# Altium schematic sheet RS485.SchDoc: RS485
size A4
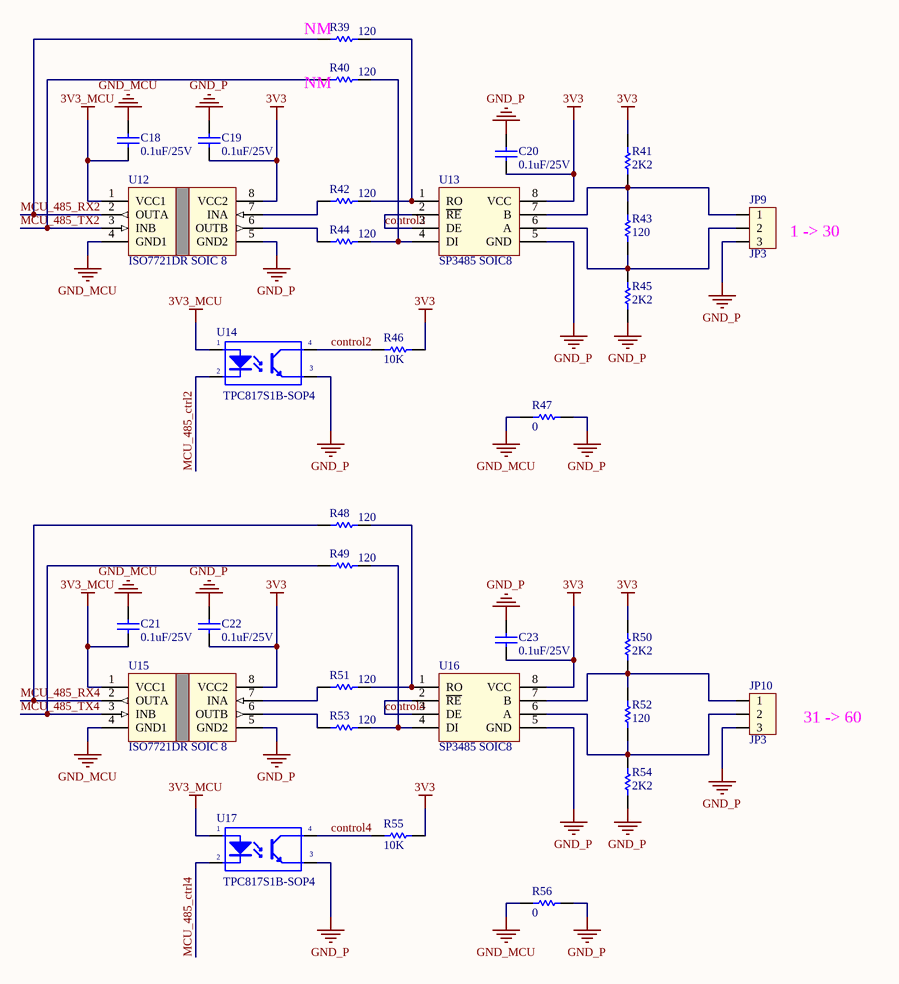
[diagram p0: RS485.SchDoc]

## Parts
C18  0.1uF/25V  [Cap Ceramic 0805 SMD]
C19  0.1uF/25V  [Cap Ceramic 0805 SMD]
C20  0.1uF/25V  [Cap Ceramic 0805 SMD]
C21  0.1uF/25V  [Cap Ceramic 0805 SMD]
C22  0.1uF/25V  [Cap Ceramic 0805 SMD]
C23  0.1uF/25V  [Cap Ceramic 0805 SMD]
JP9  JP3  [2EDGR-5.08-03P]
JP10  JP3  [2EDGR-5.08-03P]
R39  120  [Res 0805 SMD]
R40  120  [Res 0805 SMD]
R41  2K2  [Res 0805 SMD]
R42  120  [Res 0805 SMD]
R43  120  [Res 0805 SMD]
R44  120  [Res 0805 SMD]
R45  2K2  [Res 0805 SMD]
R46  10K  [Res 0805 SMD]
R47  0  [Res 0805 SMD]
R48  120  [Res 0805 SMD]
R49  120  [Res 0805 SMD]
R50  2K2  [Res 0805 SMD]
R51  120  [Res 0805 SMD]
R52  120  [Res 0805 SMD]
R53  120  [Res 0805 SMD]
R54  2K2  [Res 0805 SMD]
R55  10K  [Res 0805 SMD]
R56  0  [Res 0805 SMD]
U12  ISO7721DR SOIC 8  [ISO7721D SOIC-8 10.9mm]
U13  SP3485 SOIC8  [SP3485 SOIC-8 3.9mm]
U14  TPC817S1B-SOP4  [TPC817-4SOP]
U15  ISO7721DR SOIC 8  [ISO7721D SOIC-8 10.9mm]
U16  SP3485 SOIC8  [SP3485 SOIC-8 3.9mm]
U17  TPC817S1B-SOP4  [TPC817-4SOP]

## Nets
3V3: C19.1 C20.1 C22.1 C23.1 R41.2 R46.1 R50.2 R55.1 U12.8(VCC2) U13.8(VCC) U15.8(VCC2) U16.8(VCC)
3V3_MCU: C18.1 C21.1 U12.1(VCC1) U14.1(A) U15.1(VCC1) U17.1(A)
GND_MCU: C18.2 C21.2 R47.2 R56.2 U12.4(GND1) U15.4(GND1)
GND_P: C19.2 C20.2 C22.2 C23.2 JP9.3 JP10.3 R45.1 R47.1 R54.1 R56.1 U12.5(GND2) U13.5(GND) U14.3(E) U15.5(GND2) U16.5(GND) U17.3(E)
control2: R46.2 U13.2(~{RE}) U13.3(DE) U14.4(C)
control4: R55.2 U16.2(~{RE}) U16.3(DE) U17.4(C)
MCU_485_ctrl2: U14.2(K)
MCU_485_ctrl4: U17.2(K)
MCU_485_RX2: R39.1 U12.2(OUTA)
MCU_485_RX4: R48.1 U15.2(OUTA)
MCU_485_TX2: R40.1 U12.3(INB)
MCU_485_TX4: R49.1 U15.3(INB)
NetJP9_1: JP9.1 R41.1 R43.2 U13.7(B)
NetJP9_2: JP9.2 R43.1 R45.2 U13.6(A)
NetJP10_1: JP10.1 R50.1 R52.2 U16.7(B)
NetJP10_2: JP10.2 R52.1 R54.2 U16.6(A)
NetR39_2: R39.2 R42.2 U13.1(RO)
NetR40_2: R40.2 R44.2 U13.4(DI)
NetR42_1: R42.1 U12.7(INA)
NetR44_1: R44.1 U12.6(OUTB)
NetR48_2: R48.2 R51.2 U16.1(RO)
NetR49_2: R49.2 R53.2 U16.4(DI)
NetR51_1: R51.1 U15.7(INA)
NetR53_1: R53.1 U15.6(OUTB)

## Notes on the sheet
- (near R39) NM
- (near R40) NM
- (near JP9) 1 -> 30
- 31 -> 60
- Title
- Size:
- Date:
- A4
- Number:
- Time:
- Revision:
- Sheet
- of
- File:

## Library data of the parts
C18-C23 = 0.1uF/25V/C0603/10%: CAP CER 0.1UF 25V 10% X7R 0603; Manufacturer: Murata Electronics North America; Manufacturer Part Number: GRM188R71E104KA01D; Capacitance: 0.1µF; RoHS: RoHS Compliant; Category: Capacitors; Packaging: Cut Tape (CT); Tolerance: ±10%; Voltage - Rated: 25V; Temperature Coefficient: X7R; Mounting Type: Surface Mount, MLCC; Operating Temperature: -55°C ~ 125°C; Applications: General Purpose; Ratings: -; Package / Case: 0603 (1608 Metric); Size / Dimension: 0.063" L x 0.031" W (1.60mm x 0.80mm); Height - Seated (Max): -; Thickness (Max): 0.035" (0.90mm); Lead Spacing: -; Features: -; Lead Style: -; ComponentLink1URL: http://www.murata.com/~/media/webrenewal/support/library/catalog/products/capacitor/mlcc/c02e.ashx; ComponentLink1Description: http://www.murata.com/~/media/webrenewal/support/library/catalog/products/capacitor/mlcc/c02e.ashx; Supplier 1: Digi-Key; Supplier Part Number 1: 490-1524-1-ND
JP9 JP10 = Con3: Connector 3; Value: Connector 3
R39-R56 = 249K/R0805/1%: RES SMD 249K OHM 1% 1/10W 0805; Manufacturer: Yageo; Manufacturer Part Number: RC0603FR-07249KL; Power (Watts): 0.1W, 1/10W; Temperature Coefficient: ±100ppm/°C; Supplier 1: Digi-Key; RoHS: RoHS Compliant; Category: Resistors; Stock 1: 370515; Pricing 1: 1=0.1, 10=0.015, 100=0.006, 1000=0.00268, 2500=0.00233 (USD); Packaging: Cut Tape (CT); Part Status: Active; Tolerance: ±1%; Composition: Thick Film; Features: Moisture Resistant; Operating Temperature: -55°C ~ 155°C; Package / Case: 0603 (1608 Metric); Supplier Device Package: 0603; Size / Dimension: 0.063" L x 0.032" W (1.60mm x 0.80mm); Height - Seated (Max): 0.022" (0.55mm); Failure Rate: -; ComponentLink1URL: http://www.yageo.com/documents/recent/PYu-RC_Group_51_RoHS_L_8.pdf; ComponentLink1Description: http://www.yageo.com/documents/recent/PYu-RC_Group_51_RoHS_L_8.pdf
U12 U15 = ISO7721DR SOIC 8: ISO772x High-Speed, Robust EMC, Reinforced Dual-Channel Digital Isolators
U14 U17 = PC817: Optoisolator Transistor Output 5000Vrms 1 Channel 4-SOP; Digikey: TPC817S1BRAGCT-ND